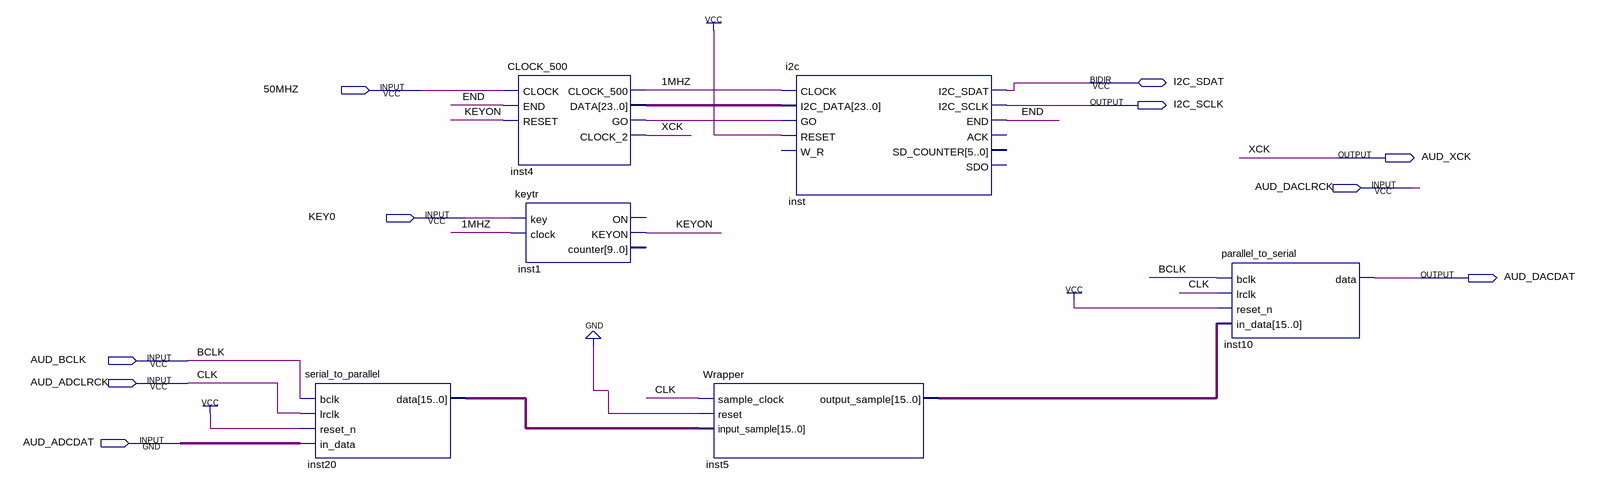
[diagram p0: schematic sheet]
// Quartus schematic DE2_i2sound.bdf as structural Verilog: 6 symbols, 10 pins
module DE2_i2sound (
  input  \50MHZ ,
  input  AUD_DACLRCK,
  input  KEY0,
  input  AUD_BCLK,
  input  AUD_ADCLRCK,
  input  AUD_ADCDAT,
  inout  I2C_SDAT,
  output I2C_SCLK,
  output AUD_XCK,
  output AUD_DACDAT
);

  wire \1MHZ , END, inst4_go, KEYON;
  wire [15:0] inst5_output_sample, inst20_data;
  wire [23:0] inst4_data;

  serial_to_parallel inst20 (
    .bclk(AUD_BCLK), .lrclk(AUD_ADCLRCK), .reset_n(1'b1), .in_data(AUD_ADCDAT), .data(inst20_data));
  CLOCK_500 inst4 (
    .CLOCK(\50MHZ ), .END(END), .RESET(KEYON), .CLOCK_500(\1MHZ ), .DATA(inst4_data), .GO(inst4_go),
    .CLOCK_2(AUD_XCK));
  keytr inst1 (.key(KEY0), .clock(\1MHZ ), .KEYON(KEYON));  // open: ON, counter
  Wrapper inst5 (
    .sample_clock(AUD_ADCLRCK), .reset(1'b0), .input_sample(inst20_data), .output_sample(inst5_output_sample));
  i2c inst (
    .CLOCK(\1MHZ ), .I2C_DATA(inst4_data), .GO(inst4_go), .RESET(1'b1), .I2C_SCLK(I2C_SCLK), .END(END),
    .I2C_SDAT(I2C_SDAT));  // open: W_R, ACK, SD_COUNTER, SDO
  parallel_to_serial inst10 (
    .bclk(AUD_BCLK), .lrclk(AUD_ADCLRCK), .reset_n(1'b1), .in_data(inst5_output_sample), .data(AUD_DACDAT));

  // Other names for the same wires on the sheet: BCLK = AUD_BCLK; CLK = AUD_ADCLRCK; XCK = AUD_XCK
endmodule
